# Altium project PCB_Project.PrjPcb
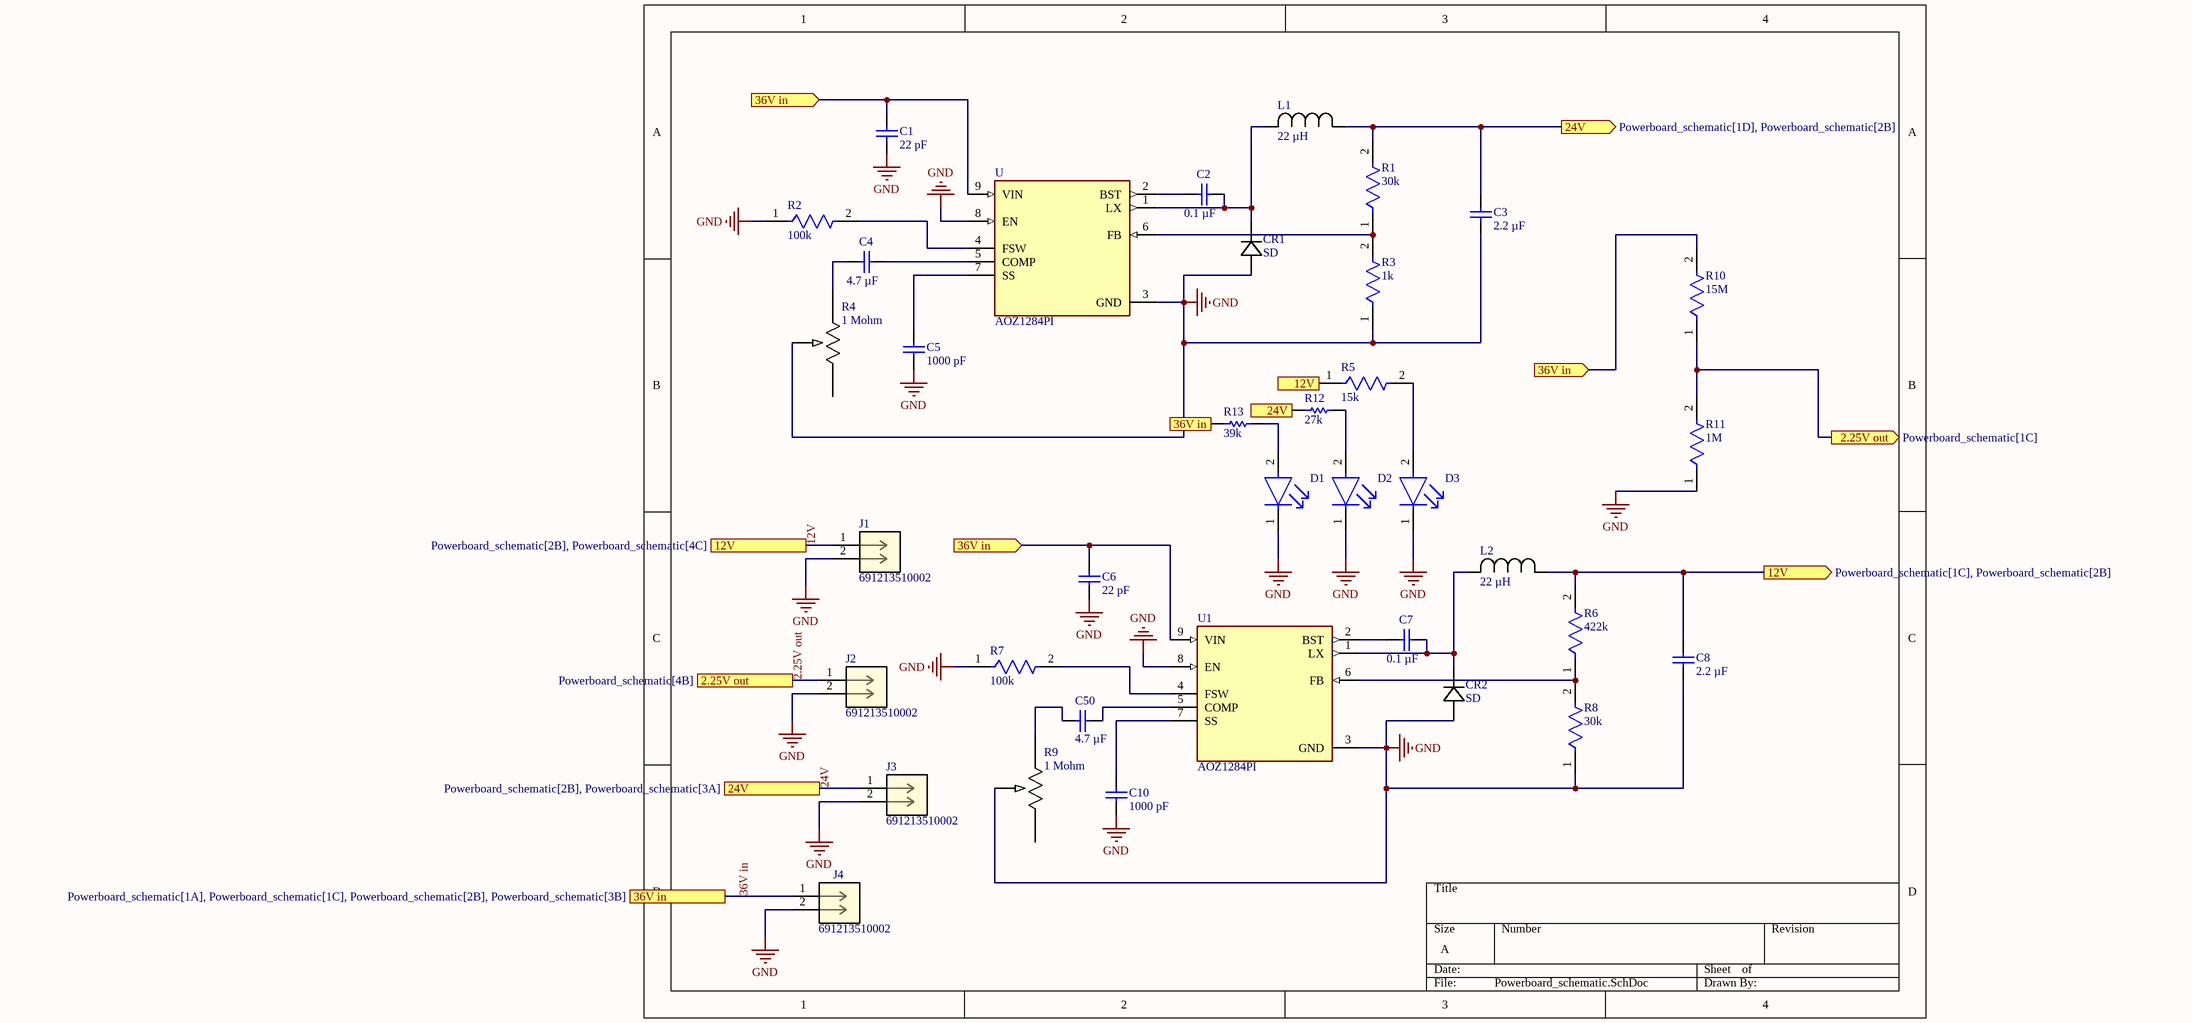
[diagram p0: Powerboard_schematic.SchDoc]
1 sheet, 36 parts. Net scope: flat (ports and power ports of the same name join across sheets).
Board file: Powerboard_PCB.PcbDoc

## Sheet Powerboard_schematic.SchDoc
size A; SheetNumber: 1; SheetTotal: 2

### Parts
C1  22 pF  [CAPC2013X140X50NL20T25]
C2  0.1 µF  [CAPC2013X140X50NL20T25]
C3  2.2 µF  [CAPC2013X140X50NL20T25]
C4  4.7 µF  [CAPC2013X140X50NL20T25]
C5  1000 pF  [CAPC2013X140X50NL20T25]
C6  22 pF  [CAPC2013X140X50NL20T25]
C7  0.1 µF  [CAPC2013X140X50NL20T25]
C8  2.2 µF  [CAPC2013X140X50NL20T25]
C10  1000 pF  [CAPC2013X140X50NL20T25]
C50  4.7 µF  [CAPC2013X145X48ML20T23]
CR1  SD  [SD2114_AVX]
CR2  SD  [SD2114_AVX]
D1  LTST-C171GKT  [FP-LTST-C171GKT-MFG]  (value not drawn)
D2  LTST-C171GKT  [FP-LTST-C171GKT-MFG]  (value not drawn)
D3  LTST-C171GKT  [FP-LTST-C171GKT-MFG]  (value not drawn)
J1  691213510002  [CONN_691213510002_WRE]
J2  691213510002  [CONN_691213510002_WRE]
J3  691213510002  [CONN_691213510002_WRE]
J4  691213510002  [CONN_691213510002_WRE]
L1  22 µH  [IND_CTDO1813PF-223HC_CTH]
L2  22 µH  [IND_CTDO1813PF-223HC_CTH]
R1  30k  [FP-CRCW0805-e3-IPC_B]
R2  100k  [FP-CRCW0805-e3-IPC_B]
R3  1k  [FP-CRCW0805-e3-IPC_B]
R4  1 Mohm  [TRIM_PV36W105C01B00]
R5  15k  [FP-RN732A-MFG]
R6  422k  [FP-CRCW0805-e3-IPC_B]
R7  100k  [FP-CRCW0805-e3-IPC_B]
R8  30k  [FP-CRCW0805-e3-IPC_B]
R9  1 Mohm  [TRIM_PV36W105C01B00]
R10  15M  [FP-CRCW0805-e3-IPC_B]
R11  1M  [FP-CRCW0805-e3-IPC_B]
R12  27k  [RESC2013X60X40NL20T25]
R13  39k  [RESC2013X60X40LL20T25]
U  AOZ1284PI  [SOP127P600X170-9N]
U1  AOZ1284PI  [SOP127P600X170-9N]

### Ports
2.25V out (out, see Powerboard_schematic[1C]), 2.25V out (see Powerboard_schematic[4B]), 12V (out, see Powerboard_schematic[1C], Powerboard_schematic[2B]), 12V (see Powerboard_schematic[1C], Powerboard_schematic[4C]), 12V (see Powerboard_schematic[2B], Powerboard_schematic[4C]), 24V (out, see Powerboard_schematic[1D], Powerboard_schematic[2B]), 24V (see Powerboard_schematic[1D], Powerboard_schematic[3A]), 24V (see Powerboard_schematic[2B], Powerboard_schematic[3A]), 36V in (in, see Powerboard_schematic[0D], Powerboard_schematic[1A], Powerboard_schematic[1C], Powerboard_schematic[2B]), 36V in (in, see Powerboard_schematic[0D], Powerboard_schematic[1A], Powerboard_schematic[2B], Powerboard_schematic[3B]), 36V in (in, see Powerboard_schematic[0D], Powerboard_schematic[1C], Powerboard_schematic[2B], Powerboard_schematic[3B]), 36V in (see Powerboard_schematic[0D], Powerboard_schematic[1A], Powerboard_schematic[1C], Powerboard_schematic[3B]), 36V in (see Powerboard_schematic[1A], Powerboard_schematic[1C], Powerboard_schematic[2B], Powerboard_schematic[3B])

### Nets
GND: C1.1 C3.1 C5.1 C6.1 C8.1 C10.1 CR1.2 CR2.2 D1.1(C) D2.1(C) D3.1(C) J1.2 J2.2 J3.2 J4.2 R2.1 R3.1 R4.2 R7.1 R8.1 R9.2 R11.1 U.3(GND) U.8(EN) U1.3(GND) U1.8(EN)
2.25V out: J2.1 R10.1 R11.2 ; port 2.25V out
12V: C8.2 J1.1 L2.1 R5.1 R6.2 ; port 12V
24V: C3.2 J3.1 L1.1 R1.2 R12.1 ; port 24V
36V in: C1.2 C6.2 J4.1 R10.2 R13.1 U.9(VIN) U1.9(VIN) ; port 36V in
NetC2_1: C2.1 U.2(BST)
NetC2_2: C2.2 CR1.1 L1.2 U.1(LX)
NetC4_1: C4.1 U.5(COMP)
NetC4_2: C4.2 R4.3
NetC5_2: C5.2 U.7(SS)
NetC7_1: C7.1 U1.2(BST)
NetC7_2: C7.2 CR2.1 L2.2 U1.1(LX)
NetC10_2: C10.2 U1.7(SS)
NetC50_1: C50.1 R9.3
NetC50_2: C50.2 U1.5(COMP)
NetD1_2: D1.2(A) R13.2
NetD2_2: D2.2(A) R12.2
NetD3_2: D3.2(A) R5.2
NetR1_1: R1.1 R3.2 U.6(FB)
NetR2_2: R2.2 U.4(FSW)
NetR6_1: R6.1 R8.2 U1.6(FB)
NetR7_2: R7.2 U1.4(FSW)

Not connected (* = marked no-connect by the designer): R4 1; R9 1

### Library data of the parts
C1-C8 C10 = CMP-2007-04629-1: Part Number: 08055C104K4Z2A; Manufacturer: AVX Interconnect / Elco
C50 = CMP-2007-03057-1: Manufacturer: Vitramon; Part Number: VJ0805A1R0CXACW1BC
CR1 CR2 = SD2114S040S8R0: No Description Available; Mfr_Name: KYOCERA AVX; Type: DEV; Copyright: Copyright (C) 2022 Ultra Librarian. All rights reserved.; Manufacturer_Part_Number: SD2114S040S8R0; Digi-Key_Part_Number_1: 478-7817-1-ND; Digi-Key_Part_Number_2: 478-7817-2-ND; Digi-Key_Part_Number_3: 478-7817-6-ND; RefDes: RefDes
D1-D3 = CMP-22017-000007-1: LED GREEN CLEAR CHIP SMD; Luminous Intensity: 12mcd; Lens Color: Colorless; Dominant Wavelength: 569nm; Number of LEDs: 1; Power Dissipation: 100mW; Viewing Angle: 130°; Reverse Voltage: 5V; Test Current: 10mA; Forward Voltage: 2.1V; Wavelength: 585nm; Lens Style: Diffused; Forward Current: 30mA; Height: 0.8mm; Mount: Surface Mount; Package Quantity: 1; Length: 2mm; Case Code (Metric): 2012; Number of Pins: 2; Number of Elements: 1; Packaging: Tape and Reel; Color: Green; Min Operating Temperature: -55°C; Case/Package: 0805; Power Rating: 100mW; Max Operating Temperature: 85°C; Radiation Hardening: No; Depth: 1.25mm; Lens Transparency: Clear; Width: 1.25mm; Lead Free: Lead Free; Case Code (Imperial): 0805; Illumination Color: Green
J1-J4 = 691213510002: No Description Available; Mfr_Name: Wurth Electronics; Copyright: Copyright (C) 2023 Ultra Librarian. All rights reserved.; Manufacturer_Part_Number: 691213510002; Digi-Key_Part_Number_1: 732-691213510002-ND; RefDes: RefDes; Type: DEV
L1 L2 = CTDO1813PF-223HC: No Description Available; Mfr_Name: Central Technologies; Type: DEV; Copyright: Copyright (C) 2023 Ultra Librarian. All rights reserved.; Manufacturer_Part_Number: CTDO1813PF-223HC; RefDes: RefDes
R1-R3 R6-R8 R10 R11 = CMP-2001-03630-2: RES Thick Film, 1MΩ, 1%, 0.125W, 100ppm/°C, 0805; Voltage Rating (DC): 150V; Resistance: 1MR; Power Rating: 125mW; Packaging: Tape and Reel; Case Code (Metric): 2012; Case/Package: 0805; Width: 1.25mm; Mount: Surface Mount; Military Standard: Not; Radiation Hardening: No; Weight: 0.000194oz; Package Quantity: 5000; Max Operating Temperature: 155°C; Contact Plating: Tin; Composition: Thick Film; Number of Pins: 2; Tolerance: 1%; Termination: SMD/SMT; Case Code (Imperial): 0805; Depth: 1.25mm; Temperature Coefficient: 100ppm/°C; Min Operating Temperature: -55°C; Height: 0.45mm; Lead Free: Lead Free; Length: 2mm; Voltage Rating: 150V
R4 R9 = PV36W105C01B00: No Description Available; Mfr_Name: Murata; Copyright: Copyright (C) 2022 Ultra Librarian. All rights reserved.; Manufacturer_Part_Number: PV36W105C01B00; Digi-Key_Part_Number_1: 490-2877-ND; RefDes: RefDes; Type: DEV
R5 = CMP-03211-006689-1: SMD Chip Resistor, Thin Film, 15KΩ, 100 V, 0805 [2012 Metric], 100 mW, 0.1%, RN73 Series RN73C2A15KB; Manufacturer: TE Connectivity; Power Rating: 0.1W; Temperature Coefficient: 10ppm/°C; Voltage Rating: 100V; ComponentLink2URL: https://www.te.com/commerce/DocumentDelivery/DDEController?Action=showdoc&DocId=Data+Sheet%7F1773270%7FP%7Fpdf%7FEnglish%7FENG_DS_1773270_P.pdf%7F1676162-2; octopart_url: https://octopart.com/rn73c2a15kb-te+connectivity-47108263; Temperature: -55°C to 155°C; Temperature Range Low: -55°C; Ipc Land Pattern Name: RESC200125X55; Series: RN73; Package: RN732A; Lead Free: Yes; Device Class L2: Resistors; Resistance: 15KΩ; Octopart: https://octopart.com/rn73c2a15kb-te+connectivity-47108263; RoHS: TRUE; Composition: Thin Film; ComponentLink2Description: Datasheet; Height: 0.65mm; Temperature Range High: 155°C; Category: Res; Automotive: No; packaging: Custom; Tolerance: 0.1%; Device Class L3: Chip SMD Resistors; Device Class L1: Passive Components; Value: 15KΩ; Manufacturer Part Number: RN73C2A15KB
R12 = CMP-2001-00688-1: ERA-6AED273V; Manufacturer: Panasonic; Part Number: ERA-6AED273V
R13 = CMP-2001-00636-1: ERA6AEB393V; Manufacturer: Panasonic; Part Number: ERA6AEB393V
U U1 = AOZ1284PI: Buck Switching Regulator IC Positive Adjustable 0.8V 1 Output 4A 8-SOIC _0.154, 3.90mm Width_ Exposed Pad; MF: Alpha &; Price: None; Availability: Unavailable; Package: SO-8 Alpha &amp; Omega Semiconductor; SnapEDA_Link: https://www.snapeda.com/parts/AOZ1284PI/Alpha%20%26%20Omega%20Semiconductor%20Inc./view-part/473739/?ref=snap; MP: AOZ1284PI; Value: *